# EAGLE design 7-segment (EAGLE 6.2)
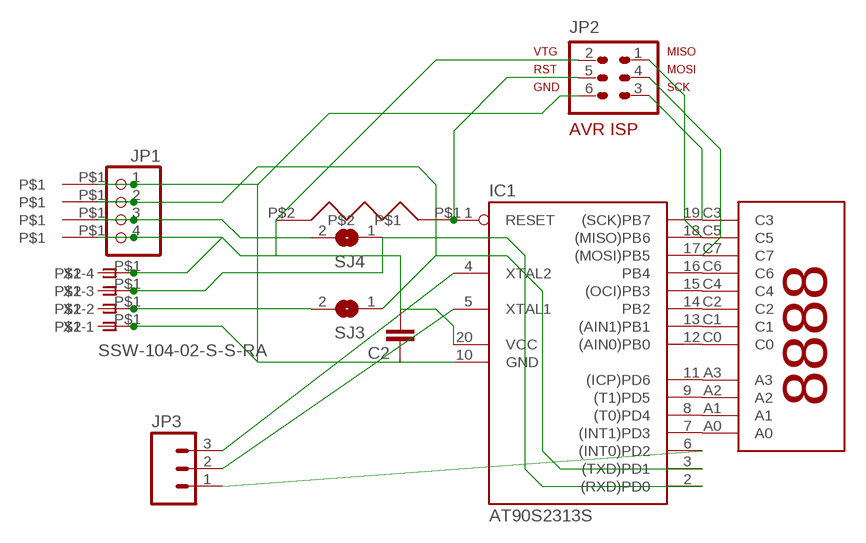
[diagram p0: schematic, sheet 1]

## Parts
C2  CAPPTH  [CAP-PTH-SMALL]
IC1  AT90S2313S  [SO20L]
JP1  PINHD-1X4/90  [1X04/90]
JP2  AVR-ISP-6  [AVR-ISP-6]
JP3  M03PTH  [1X03]
SJ3  SJ  [SJ]
SJ4  SJ  [SJ]
U$1  7-SEGMENT-DISPLAY-5462-BS  [7SEG_5462BS]
U$2  R-6  [R-6]
U$3  WIREPAD_SQUARE_1  [WIREPAD_SQUARE_1]
U$4  WIREPAD_SQUARE_1  [WIREPAD_SQUARE_1]
U$5  WIREPAD_SQUARE_1  [WIREPAD_SQUARE_1]
U$6  WIREPAD_SQUARE_1  [WIREPAD_SQUARE_1]
U$7  WIREPAD_SQUARE_1  [WIREPAD_SQUARE_1]
U$8  WIREPAD_SQUARE_1  [WIREPAD_SQUARE_1]
U$9  WIREPAD_SQUARE_1  [WIREPAD_SQUARE_1]
U$10  WIREPAD_SQUARE_1  [WIREPAD_SQUARE_1]
X2  SSW-104-02-S-S-RA  [SSW-104-02-S-S-RA]

## Nets
N$1: IC1.15((OCI)PB3) U$1.C4
N$2: IC1.16(PB4) U$1.C6
N$3: IC1.17((MOSI)PB5) JP2.4 U$1.C7
N$4: IC1.18((MISO)PB6) JP2.1 U$1.C5
N$5: IC1.19((SCK)PB7) JP2.3 U$1.C3
N$6: IC1.11((ICP)PD6) U$1.A3
N$7: IC1.7((INT1)PD3) U$1.A0
N$8: IC1.12((AIN0)PB0) U$1.C0
N$9: IC1.13((AIN1)PB1) U$1.C1
N$10: IC1.8((T0)PD4) U$1.A1
N$11: IC1.9((T1)PD5) U$1.A2
N$12: IC1.14(PB2) U$1.C2
N$13: C2.2 IC1.20(VCC) JP1.4 JP2.2 U$2.P$2 U$6.P$1 U$7.P$1 X2.4
N$14: C2.1 IC1.10(GND) JP1.1 JP2.6 U$3.P$1 U$10.P$1 X2.1
N$15: SJ3.2 U$9.P$1 X2.2
N$16: JP1.3 SJ4.2 U$5.P$1
N$17: IC1.2((RXD)PD0) SJ4.1 U$8.P$1 X2.3
N$18: IC1.1(RESET) JP2.5 U$2.P$1
N$19: IC1.3((TXD)PD1) JP1.2 SJ3.1 U$4.P$1
PD2: IC1.6((INT0)PD2) JP3.1
XTAL0: IC1.4(XTAL2) JP3.3
XTAL1: IC1.5(XTAL1) JP3.2

## Library data of the parts
C2 = SparkFun:CAP: Capacitor Standard 0603 ceramic capacitor, and 0.1" leaded capacitor.
IC1 = avr-5-4.16:AT90S2313: MICROCONTROLLER 2 Kbytes FLASH 128 bytes SRAM 128 bytes EEPROM UART
JP1 = pinhead:PINHD-1X4: PIN HEADER
JP2 = avr-5-4.16:AVR-ISP-6: AVR ISP-6 Serial Programming Header
JP3 = SparkFun:M03: Header 3 Standard 3-pin 0.1" header. Use with straight break away headers (SKU : PRT-00116), right angle break away headers (PRT-00553), swiss pins (PRT-00743), machine pins (PRT-00117), and female headers (PRT-00115). Molex polarized connector foot print use with SKU : PRT-08232 with associated crimp pins and housings.
SJ3 SJ4 = jumper:SJ: SMD solder JUMPER
U$1 = Mrule:7-SEGMENT-DISPLAY-5462-BS
U$2 = Mrule:R-6
U$3-U$10 = Mrule:WIREPAD_SQUARE_1
X2 = con-samtec:SSW-104-02-S-S: THROUGH-HOLE .025" SQ POST SOCKET Source: Samtec SSW.pdf; MPN: SSW-104-02-S-S-RA; OC_FARNELL: unknown; OC_NEWARK: 11P9385

## Board
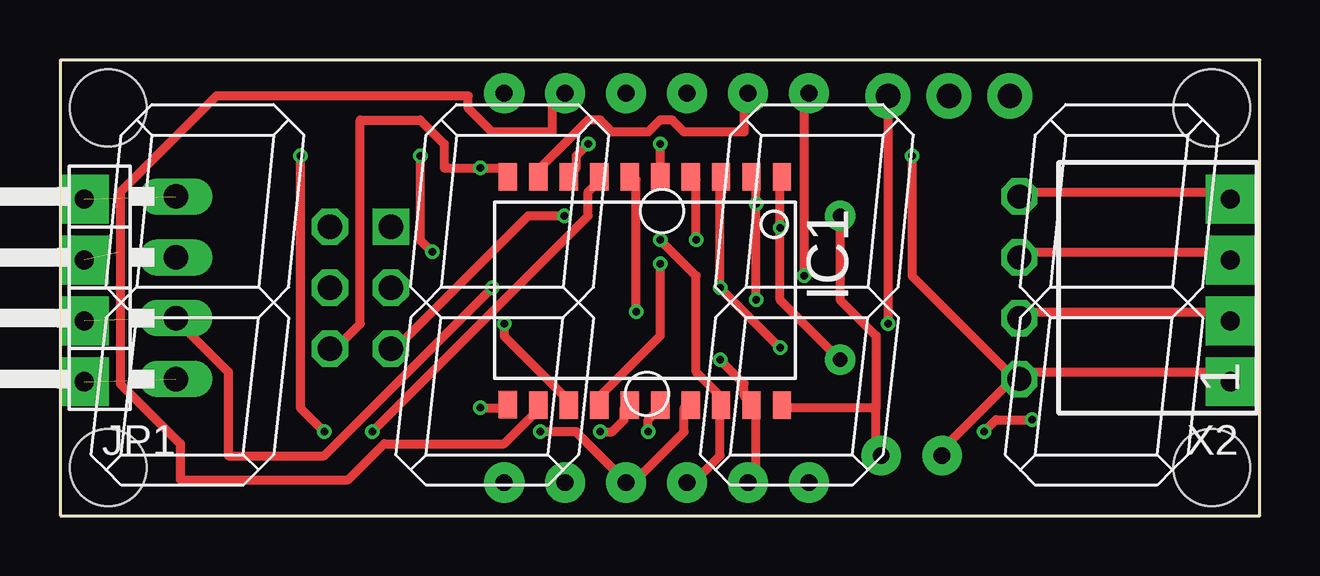
[diagram p1: board, top side]
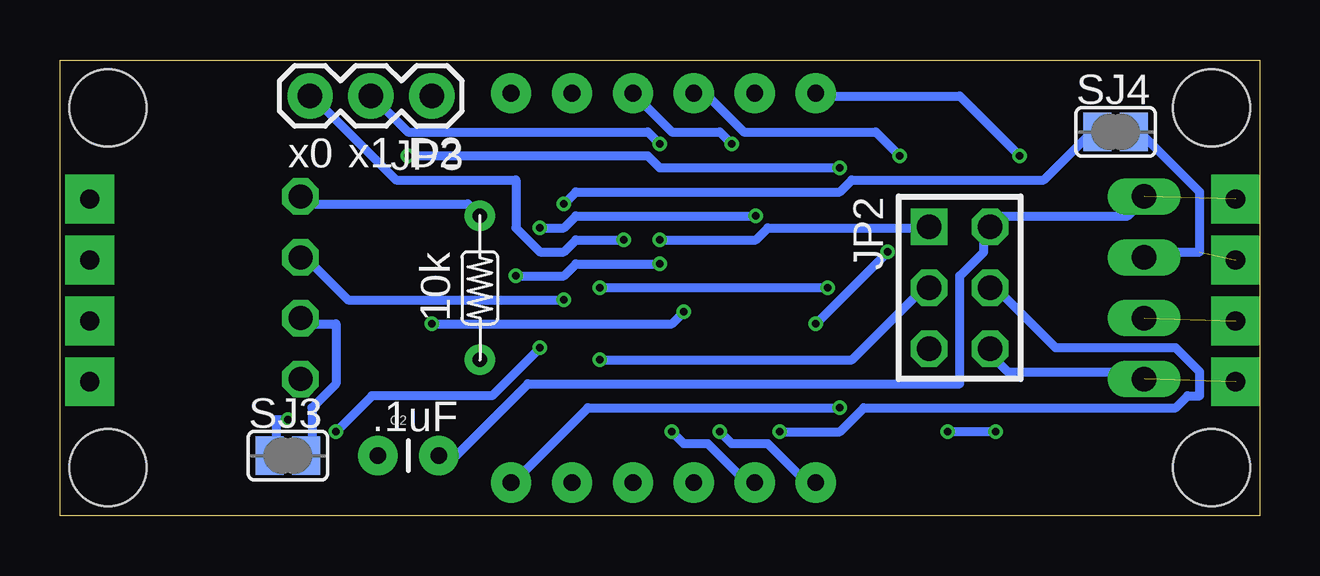
[diagram p2: board, bottom side, seen from below]

Size 50 x 19 mm. Coordinates in mm from the lower left corner, seen from the top.
Outline: 0,0 50,0 50,19 0,19 0,0
Copper layers (1*16): Top 0.035mm / dielectric 1.5mm / Bottom 0.035mm
Design rules: minimum track width 15mil, minimum drill 12mil, track to track 7mil, track to pad 7mil, pad to pad 7mil, via to via 7mil, smd to smd 0mil, copper to edge 40mil, drill to drill 10mil, minimum pad ring 10mil, minimum via ring 6mil, stop-mask expansion 2mil, vias tented up to drill 100mil, thermal gap 10mil
Holes 3.2 mm at 2,17 2,2 48,17 48,2

### Footprints (pad centres in the part's own frame; a part is rotated, then mirrored left to right if it is on the bottom)
CAP-PTH-SMALL = drill 0.7 pad 1.651: 1 0,0; 2 2.54,0
SO20L = smd 0.762 x 1.143: 1 -5.08,-5.131; 2 -3.81,-5.131; 3 -2.54,-5.131; 4 -1.27,-5.131; 5 0,-5.131; 6 1.27,-5.131; 7 2.54,-5.131; 8 3.81,-5.131; 9 5.08,-5.131; 10 6.35,-5.131; 11 6.35,4.369; 12 5.08,4.394; 13 3.81,4.394; 14 2.54,4.394; 15 1.27,4.394; 16 0,4.394; 17 -1.27,4.394; 18 -2.54,4.394; 19 -3.81,4.394; 20 -5.08,4.394
1X04/90 = drill 1.016 long: 1 -3.81,-3.81; 2 -1.27,-3.81; 3 1.27,-3.81; 4 3.81,-3.81
AVR-ISP-6 = drill 1.016 square: 1 -2.54,-1.27 | drill 1.016 octagon: 2 -2.54,1.27; 3 0,-1.27; 4 0,1.27; 5 2.54,-1.27; 6 2.54,1.27
1X03 = drill 1.016 pad 1.88: 1 0,0; 2 2.54,0; 3 5.08,0
SJ = smd 1.168 x 1.6: 1 -0.762,0; 2 0.762,0
7SEG_5462BS = drill 0.7 pad 1.676: A0 18.5,17.615; A1 26.12,17.615; A2 28.66,17.615; A3 31.2,1.375; C0 21.04,17.615; C1 23.58,17.615; C2 31.2,17.615; C3 28.66,1.375; C4 18.5,1.375; C5 26.12,1.375; C6 21.04,1.375; C7 23.58,1.375
R-6 = drill 0.6 pad 1.27: P$1 -3,0; P$2 3,0
WIREPAD_SQUARE_1 = drill 0.8 pad 2.032 square: P$1 0,0
SSW-104-02-S-S-RA = drill 1 pad 1.5 octagon: 1 -3.81,1.524; 2 -1.27,1.524; 3 1.27,1.524; 4 3.81,1.524

### Placement (x,y rotation side)
C2  36.75,2.5 0 bottom
IC1  25,9 180 top
JP1  1,9.5 90 top
JP2  12.5,9.5 270 bottom
JP3  34.5,17.5 180 bottom
SJ3  40.5,2.5 0 bottom
SJ4  6,16 0 bottom
U$1  0,0 0 top
U$2  32.5,9.5 90 bottom
U$3  48.76,5.58 0 top
U$4  1,8.12 0 top
U$5  1,10.66 0 top
U$6  1,13.2 0 top
U$7  48.76,13.2 0 top
U$8  48.76,10.66 0 top
U$9  48.76,8.12 0 top
U$10  1,5.58 0 top
X2  41.5,9.5 90 top

### Tracks (layer width: path | path; a pad name or v marks a point on that pad's centre or on a via)
N$1  (via drill 0.3)
  Top 0.381: v22.5,3.5 23,3.5 23.5,4 23.5,4.5 IC1.15
  Bottom 0.381: v22.5,3.5 22,3 20.5,3 19,1.5 18.5,1.5 U$1.C4
N$2  (via drill 0.3)
  Top 0.381: v24.5,3.5 24.5,4 25,4.5 IC1.16
  Bottom 0.381: v24.5,3.5 24,3 23,3 21.5,1.5 U$1.C6
N$3  (via drill 0.3)
  Top 0.381: IC1.17 26,4.5 26,3.5 24,1.5 U$1.C7 23.5,1.5 21.5,3.5 v20,3.5
  Bottom 0.381: v20,3.5 17.5,3.5 16.5,4.5 3.5,4.5 3,5 2.5,5 2.5,6 3.5,7 8.5,7 11,9.5 JP2.4
N$4  (via drill 0.3)
  Top 0.381: U$1.C5 26.5,1.5 27.5,2.5 27.5,4.5 IC1.18 27.5,5 26.5,6 26.5,10 v25,11.5
  Bottom 0.381: v25,11.5 21,11.5 20.5,12 14,12 JP2.1
N$5  (via drill 0.3)
  Top 0.381: U$1.C3 29,1.5 29,4.5 IC1.19 28.5,5 28.5,5.5 v27.5,6.5
  Bottom 0.381: v27.5,6.5 17,6.5 14,9.5 JP2.3
N$6  (via drill 0.3)
  Top 0.381: v17.5,4.5 18.5,4.5 IC1.11
  Bottom 0.381: v17.5,4.5 28,4.5 31,1.5 U$1.A3
N$7  (via drill 0.3)
  Top 0.381: v13,3.5 22,12.5 22,13.5 22.5,14 IC1.7 | v11,3.5 10,4.5 v10,15
  Bottom 0.381: v11,3.5 v13,3.5 | v10,15 12.5,17.5 18.5,17.5 U$1.A0
N$8
  Top 0.381: IC1.12 20,4.5 18.5,3 13.5,3 12,1.5 5,1.5 5,3 2.5,5.5 2.5,13.5 6.5,17.5 17,17.5 17,17 18,16 20.5,16 20.5,17 21,17.5 U$1.C0
N$9  (via drill 0.3)
  Top 0.381: v18.5,8 18.5,7.5 21,5 IC1.13 | v15.5,11 15,11.5 v15,15
  Bottom 0.381: v15.5,11 v18.5,8 | v15,15 16,16 21.5,16 23,17.5 23.5,17.5 U$1.C1
N$10  (via drill 0.3)
  Top 0.381: v22,15.5 21.5,15 21.5,14.5 IC1.8
  Bottom 0.381: v22,15.5 22.5,16 24.5,16 26,17.5 U$1.A1
N$11
  Top 0.381: IC1.9 20,14.5 22,16.5 22.5,16.5 23,16 24.5,16 25,16.5 25.5,16.5 26,16 28.5,16 28.5,17.5 U$1.A2
N$12  (via drill 0.3)
  Top 0.381: v25,10.5 25,7.5 22.5,5 IC1.14 | v31,10 31,17.5 U$1.C2
  Bottom 0.381: v25,10.5 28.5,10.5 29,10 v31,10
N$13  (1 unrouted)
  Top 0.381: 34,4.5 30,4.5 IC1.20 | 34,4.5 34,2.5 C2.2 | U$7.P$1 48.5,13.5 40,13.5 X2.4 | 34,4.5 34,7.5 32.5,9 U$2.P$2
  Bottom 0.381: JP1.4 5,13 5.5,12.5 11,12.5 JP2.2 11.5,12 11.5,11 12.5,10 12.5,5.5 30.5,5.5 33.5,2.5 C2.2 | U$2.P$2 33,13 39.5,13 X2.4
N$14  (via drill 0.3)  (1 unrouted)
  Top 0.381: X2.1 39.5,5.5 37,3 37,2.5 C2.1 | U$3.P$1 48.5,6 40,6 X2.1 | IC1.10 18.5,14.5 v17.5,14.5 16,14.5 16,15.5 15,16.5 12.5,16.5 12.5,8 11.5,7 JP2.6 | v35.5,15 35.5,10 39.5,6 X2.1
  Bottom 0.381: JP1.1 5,6 10.5,6 11,6.5 JP2.6 | v35.5,15 25.5,15 25,14.5 v17.5,14.5
N$15
  Top 0.381: U$9.P$1 48.5,8.5 40,8.5 X2.2
  Bottom 0.381: SJ3.2 39.5,2.5 39.5,4.5 38.5,5.5 38.5,8 39.5,8 X2.2
N$16  (1 unrouted)
  Bottom 0.381: SJ4.2 5,16 2.5,13.5 2.5,11 4.5,11 JP1.3
N$17  (via drill 0.3)
  Top 0.381: v29,9 v29,13 29,14 IC1.2 | U$8.P$1 48.5,11 40,11 X2.3
  Bottom 0.381: v29,9 38,9 39.5,10.5 X2.3 | v29,13 28.5,13.5 17.5,13.5 17,14 9,14 7,16 SJ4.1
N$18  (via drill 0.3)
  Top 0.381: U$2.P$1 30,9 v30,12 30,14 IC1.1 | v21,12.5 19.5,12.5 14,7 JP2.5
  Bottom 0.381: v21,12.5 28.5,12.5 29,12 v30,12
N$19  (via drill 0.3)  (1 unrouted)
  Top 0.381: v18,9.5 11,2.5 7,2.5 7,6 5,8 JP1.2 | IC1.3 27.5,14 v27.5,9.5 v30,7 | v40.5,4 39,4 v38.5,3.5
  Bottom 0.381: v18,9.5 v27.5,9.5 | v40.5,4 41,4 41,2.5 SJ3.1 | v38.5,3.5 37,5 32,5 v30,7
PD2  (via drill 0.3)
  Top 0.381: v24,8.5 24,14 IC1.6 | JP3.1 v34.5,8
  Bottom 0.381: v24,8.5 24.5,8 v34.5,8
XTAL0  (via drill 0.3)
  Top 0.381: v26.5,11.5 26.5,14 IC1.4
  Bottom 0.381: v26.5,11.5 28.5,11.5 29,11 30,11 31,12 31,14 36,14 39.5,17.5 JP3.3
XTAL1  (via drill 0.3)
  Top 0.381: v25,15.5 IC1.5
  Bottom 0.381: v25,15.5 25.5,16 35.5,16 37,17.5 JP3.2

### Text on the board
bPlace: D2 | x1 | x0 | 10k | .1uF